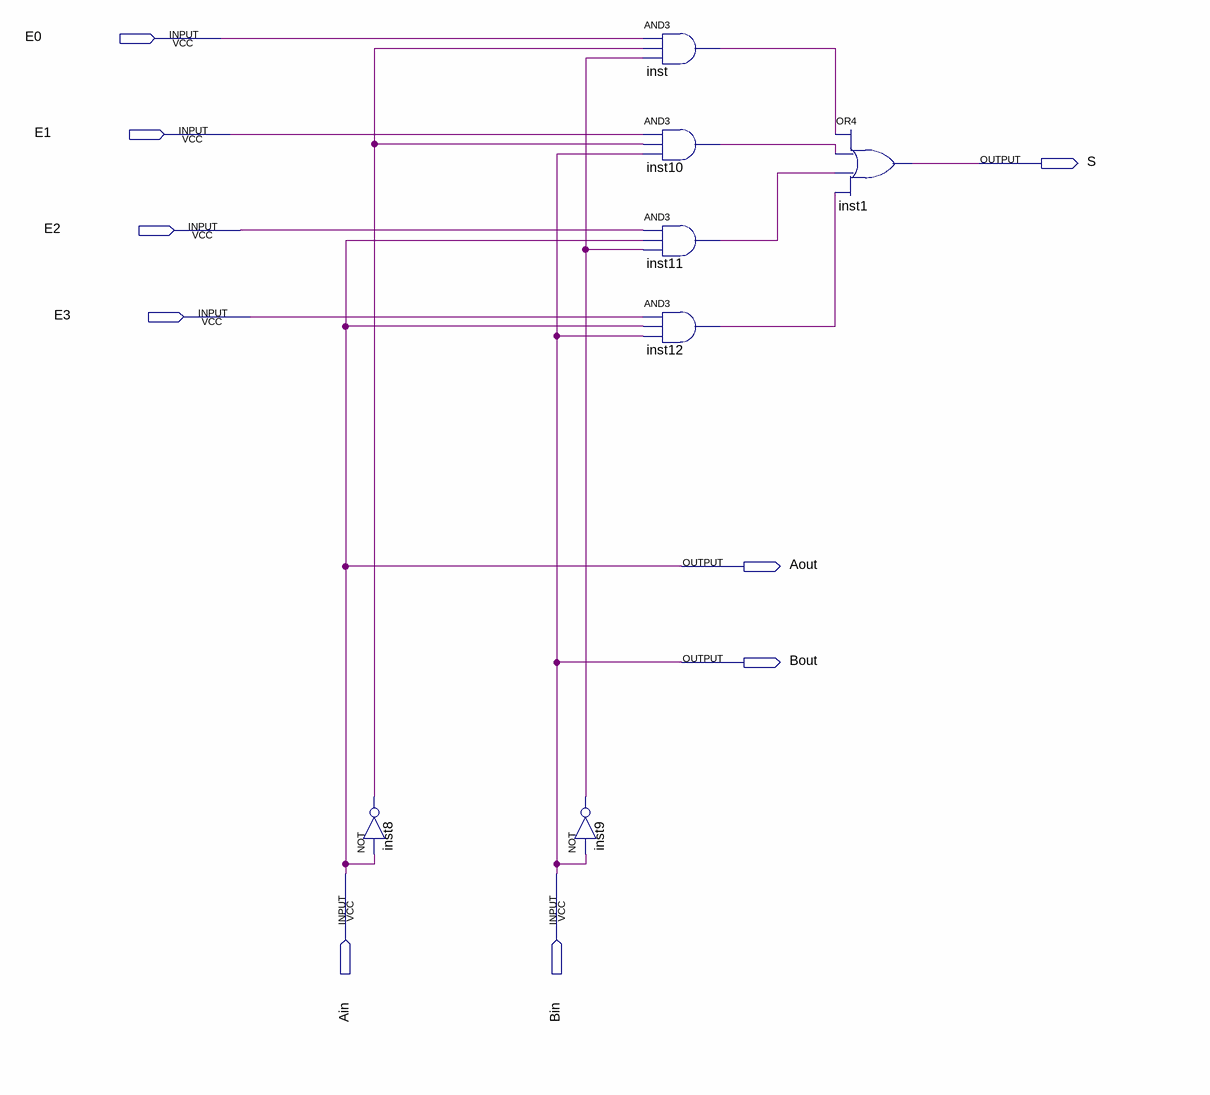
[diagram p0: schematic sheet]
// Quartus schematic 4bit_mux.bdf as structural Verilog: 7 symbols, 9 pins
module \4bit_mux  (
  input  E0,
  input  E1,
  input  E2,
  input  E3,
  input  Ain,
  input  Bin,
  output S,
  output Aout,
  output Bout
);

  wire inst8_out, inst9_out, inst10_out, inst11_out, inst12_out, inst_out;

  not inst8 (inst8_out, Ain);
  not inst9 (inst9_out, Bin);
  and inst (inst_out, E0, inst8_out, inst9_out);
  and inst10 (inst10_out, E1, inst8_out, Bin);
  and inst11 (inst11_out, E2, Ain, inst9_out);
  and inst12 (inst12_out, E3, Ain, Bin);
  or inst1 (S, inst_out, inst10_out, inst11_out, inst12_out);

  assign Aout = Ain;
  assign Bout = Bin;
endmodule
